# EAGLE design CBM_TAPE_PI (EAGLE 9.6.2)
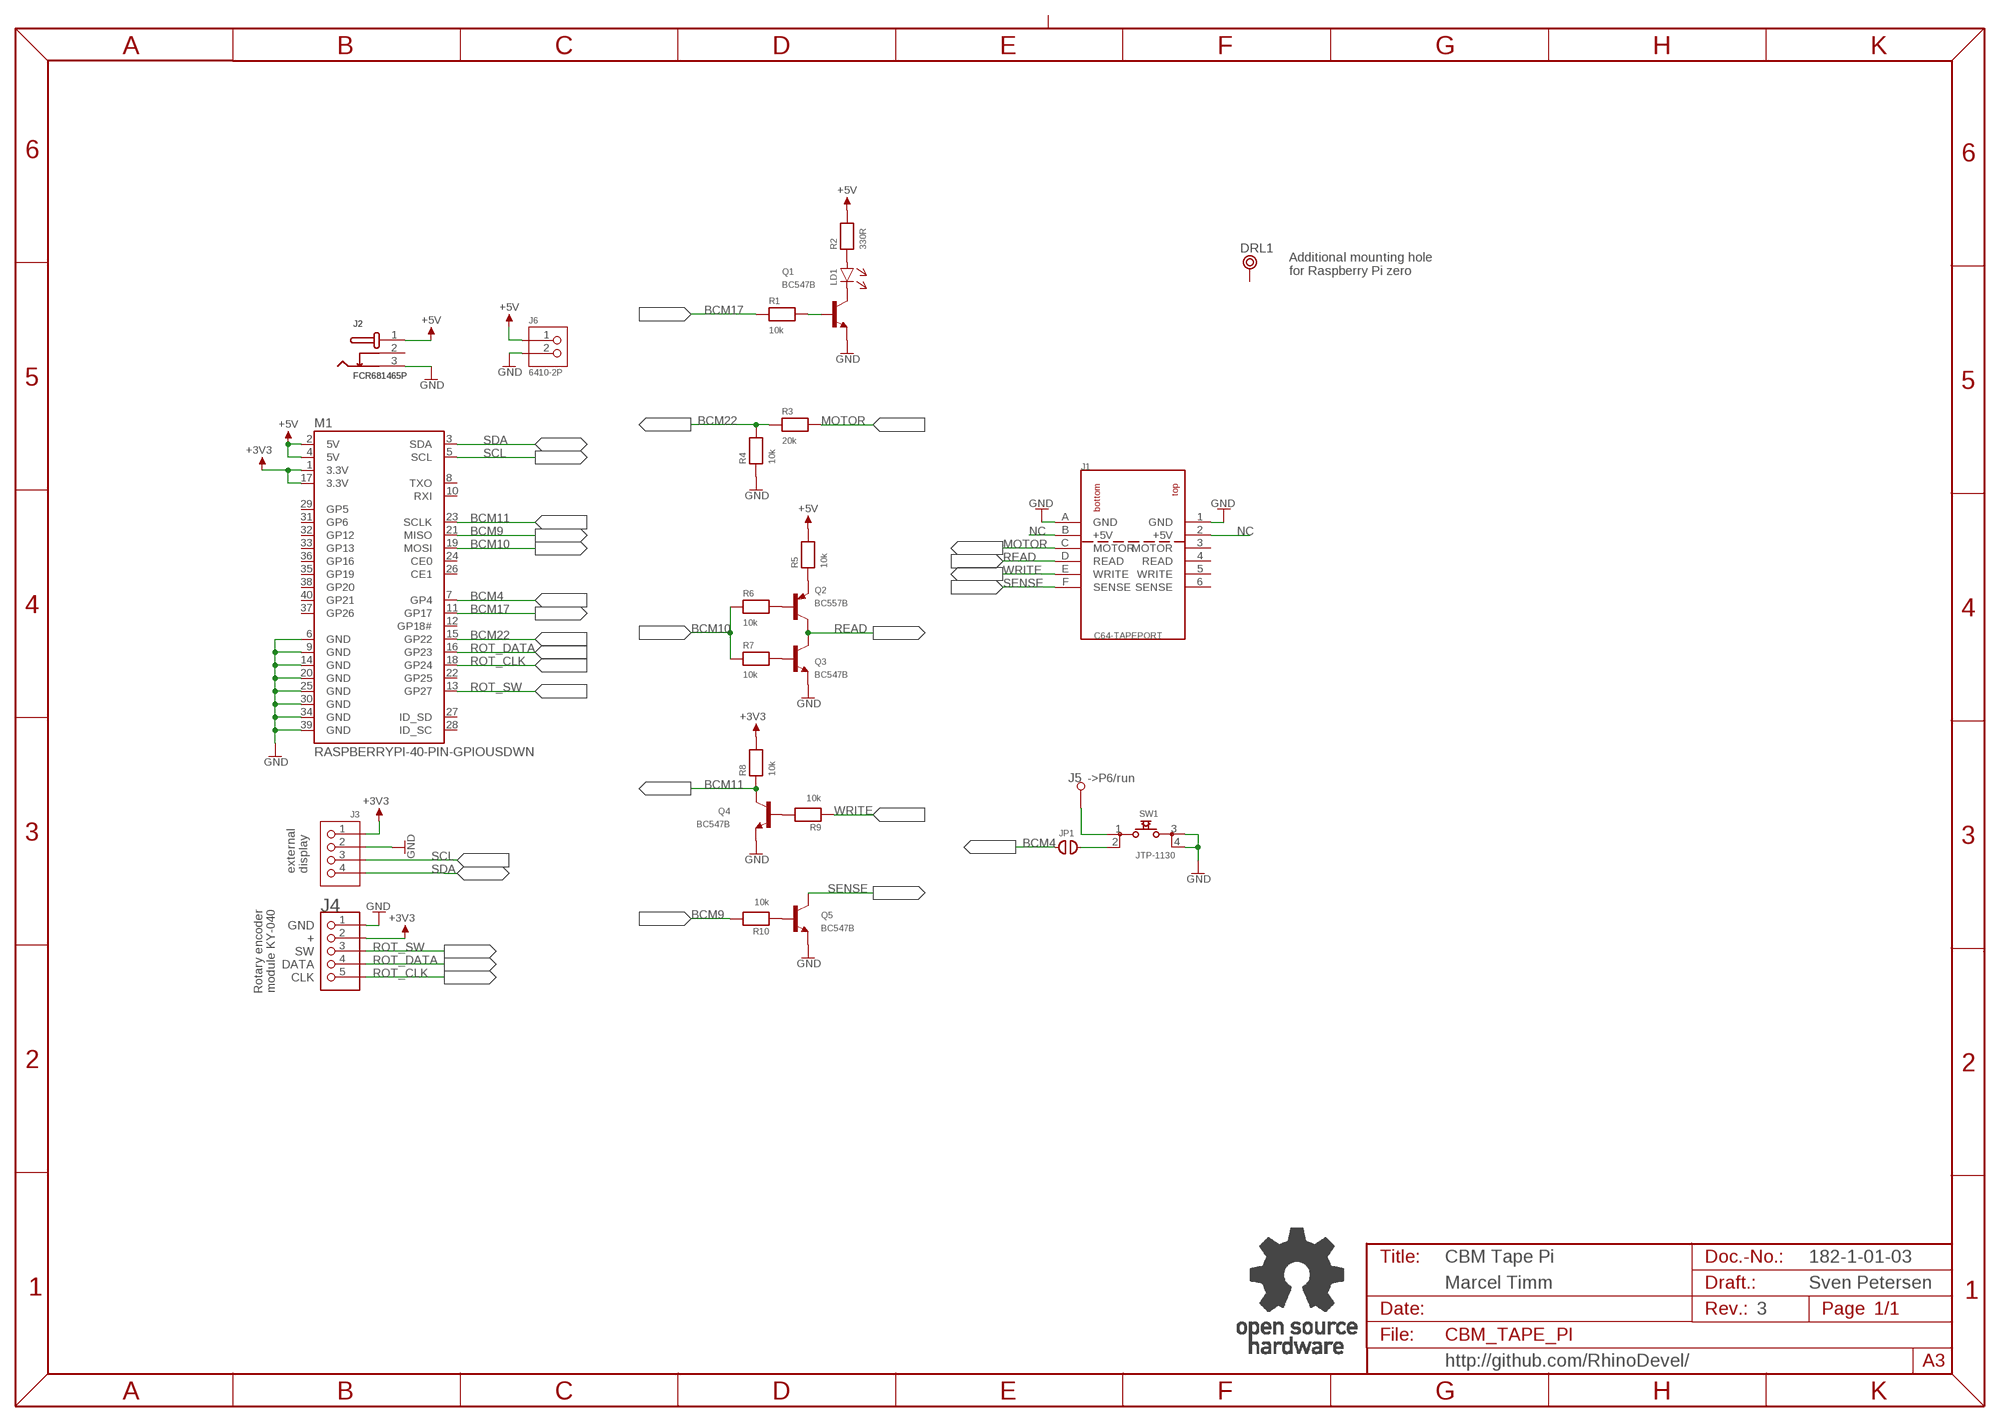
[diagram p0: schematic, sheet 1]

## Parts
DRL1  RPI_MNT  [RASPI_MNT]
J1  C64-TAPEPORT  [TAPEPORT]
J2  FCR681465P  [FCR681465P]
J3  6410-4P  [6410-4P]
J4  6410-5P  [6410-5P]
J5  L1,2_R  [1,2MM_R]
J6  6410-2P  [6410-2P]
JP1  OPEN  [CP_OP]
LD1  3MM  [3MM]
M1  RASPBERRYPI-40-PIN-GPIOUSDWN  [PI_HAT_40P_UPSIDEDOWN]
Q1  BC547B  [TO92]
Q2  BC557B  [TO92-EBC]
Q3  BC547B  [TO92]
Q4  BC547B  [TO92]
Q5  BC547B  [TO92]
R1  10k  RES04  [R-10]
R2  330R  RES04  [R-10]
R3  20k  RES04  [R-10]
R4  10k  RES04  [R-10]
R5  10k  RES04  [R-10]
R6  10k  RES04  [R-10]
R7  10k  RES04  [R-10]
R8  10k  RES04  [R-10]
R9  10k  RES04  [R-10]
R10  10k  RES04  [R-10]
SW1  JTP-1130  [JTP-1130]
U$2  OPEN_SOURCE_HW  [OPENHW]

## Nets
+3V3: J3.1 J4.2 M1.1(3.3V) M1.17(3.3V) R8.2
+5V: J2.1 J6.1 M1.2(5V) M1.4(5V) R2.2 R5.2
BCM4: JP1.1 M1.7(GP4)
BCM9: M1.21(MISO) R10.2
BCM10: M1.19(MOSI) R6.1 R7.1
BCM11: M1.23(SCLK) Q4.3(C) R8.1
BCM17: M1.11(GP17) R1.1
BCM22: M1.15(GP22) R3.1 R4.2
GND: J1.1(GND) J1.A(GND) J2.3 J3.2 J4.1 J6.2 M1.6(GND) M1.9(GND) M1.14(GND) M1.20(GND) M1.25(GND) M1.30(GND) M1.34(GND) M1.39(GND) Q1.1(E) Q3.1(E) Q4.1(E) Q5.1(E) R4.1 SW1.3 SW1.4
MOTOR: J1.C(MOTOR) R3.2
N$1: Q1.2(B) R1.2
N$2: LD1.C(K) Q1.3(C)
N$3: LD1.A R2.1
N$4: Q2.E R5.1
N$5: Q2.B R6.2
N$6: Q3.2(B) R7.2
N$7: Q4.2(B) R9.2
N$8: Q5.2(B) R10.1
N$9: J5.1 SW1.1
N$10: JP1.2 SW1.2
NC: J1.2(+5V) J1.B(+5V)
READ: J1.D(READ) Q2.C Q3.3(C)
ROT_CLK: J4.5 M1.18(GP24)
ROT_DATA: J4.4 M1.16(GP23)
ROT_SW: J4.3 M1.13(GP27)
SCL: J3.3 M1.5(SCL)
SDA: J3.4 M1.3(SDA)
SENSE: J1.F(SENSE) Q5.3(C)
WRITE: J1.E(WRITE) R9.1
Unconnected: DRL1.MH J1.3(MOTOR) J1.4(READ) J1.5(WRITE) J1.6(SENSE) J2.2 M1.8(TXO) M1.10(RXI) M1.12(GP18#) M1.22(GP25) M1.24(CE0) M1.26(CE1) M1.27(ID_SD) M1.28(ID_SC) M1.29(GP5) M1.31(GP6) M1.32(GP12) M1.33(GP13) M1.35(GP19) M1.36(GP16) M1.37(GP26) M1.38(GP20) M1.40(GP21)

## Notes on the sheet
- Additional mounting hole
  for Raspberry Pi zero
- ->P6/run
- external
  display
- GND
- +
- Rotary encoder
  module KY-040
- SW
- DATA
- CLK
- CBM Tape Pi | 182-1-01-03
- Marcel Timm | Sven Petersen
- 3
- http://github.com/RhinoDevel/

## Library data of the parts
DRL1 = Mech_Bohr:RPI_MNT
J1 = Commodore:C64-TAPEPORT
J2 = Cliff:FCR681465P
J3 = MOLEX:6410-4P: 6410/22-27-2041
J4 = MOLEX:6410-5P: 6410/22-27-2051
J5 = Pads:L1,2_R
J6 = MOLEX:6410-2P: 6410/22-27-2021
JP1 = Cutpad:OPEN: open Cutpad
LD1 = LED:3MM
M1 = Raspberry_Pi:RASPBERRYPI-40-PIN-GPIO: 40 pin GPIO header with the footprint of a HAT
Q1 Q3-Q5 = Transistoren:BC547*: NPN Transistor
Q2 = Transistoren:BC557*: PNP Transistror
R1-R10 = DISCRETE:RES04
SW1 = Namae_Electronics:JTP-1130
U$2 = Logo:OPEN_SOURCE_HW

## Board
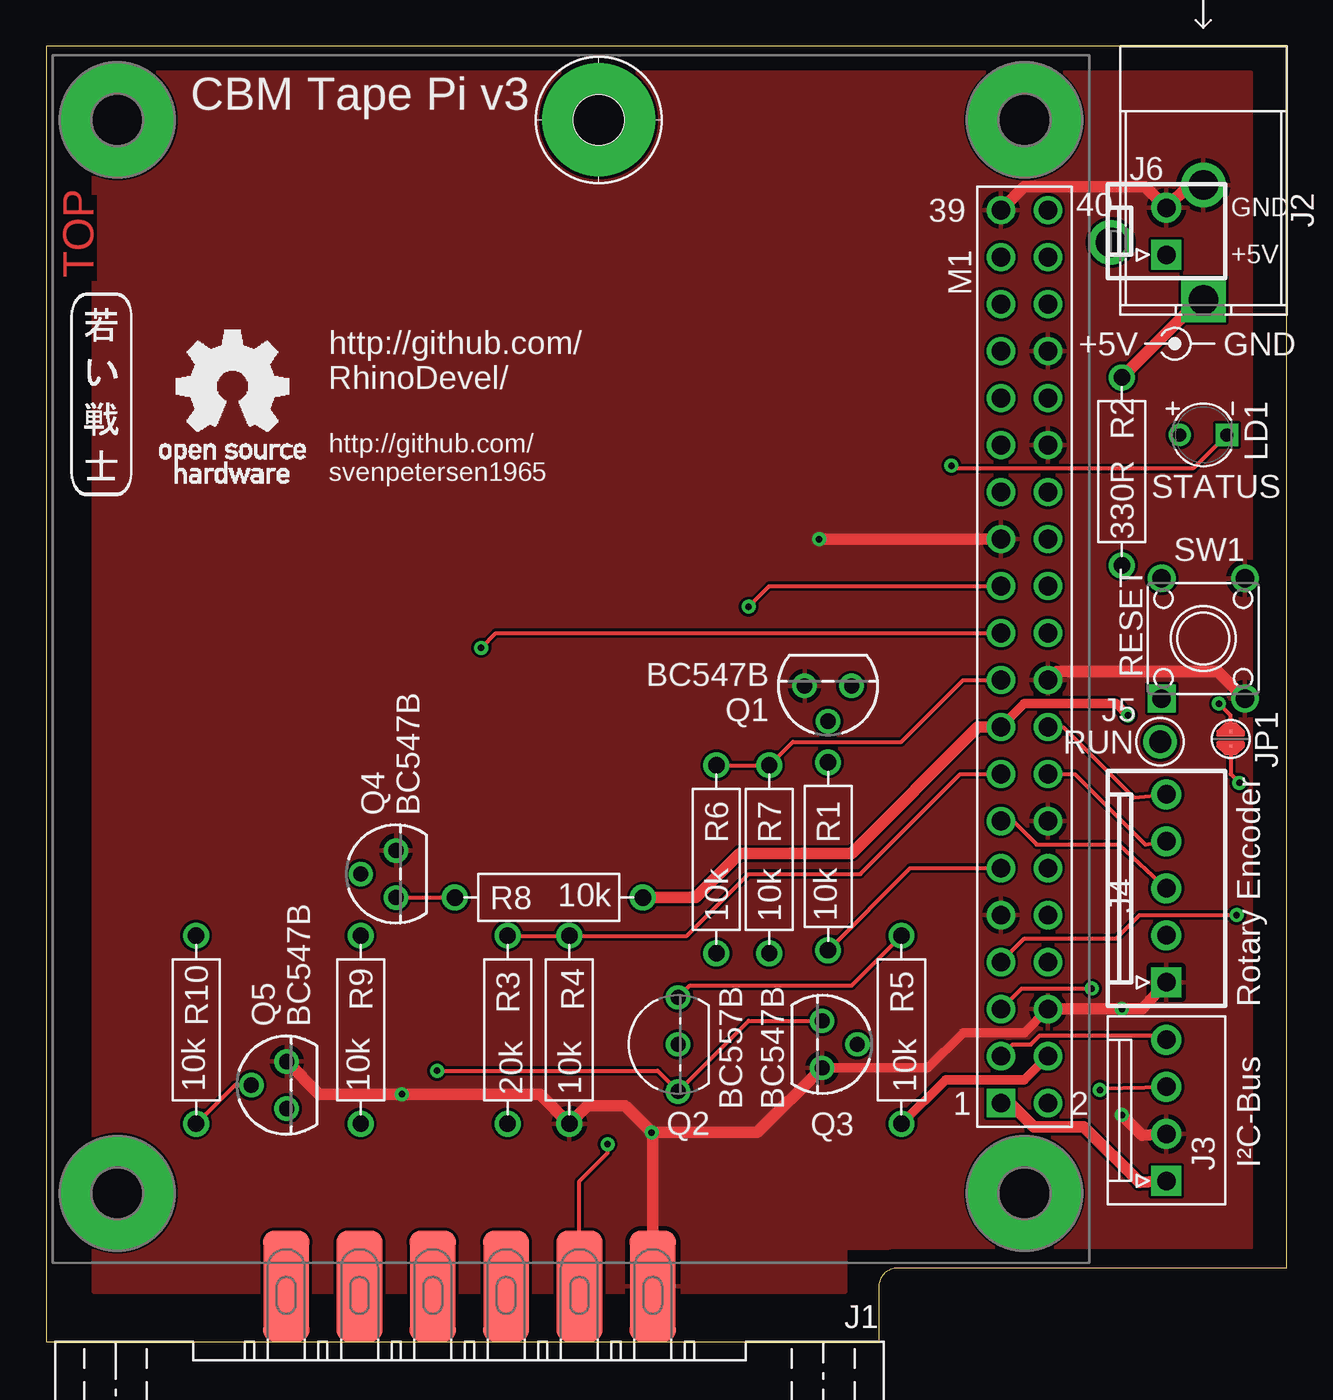
[diagram p1: board, top side]
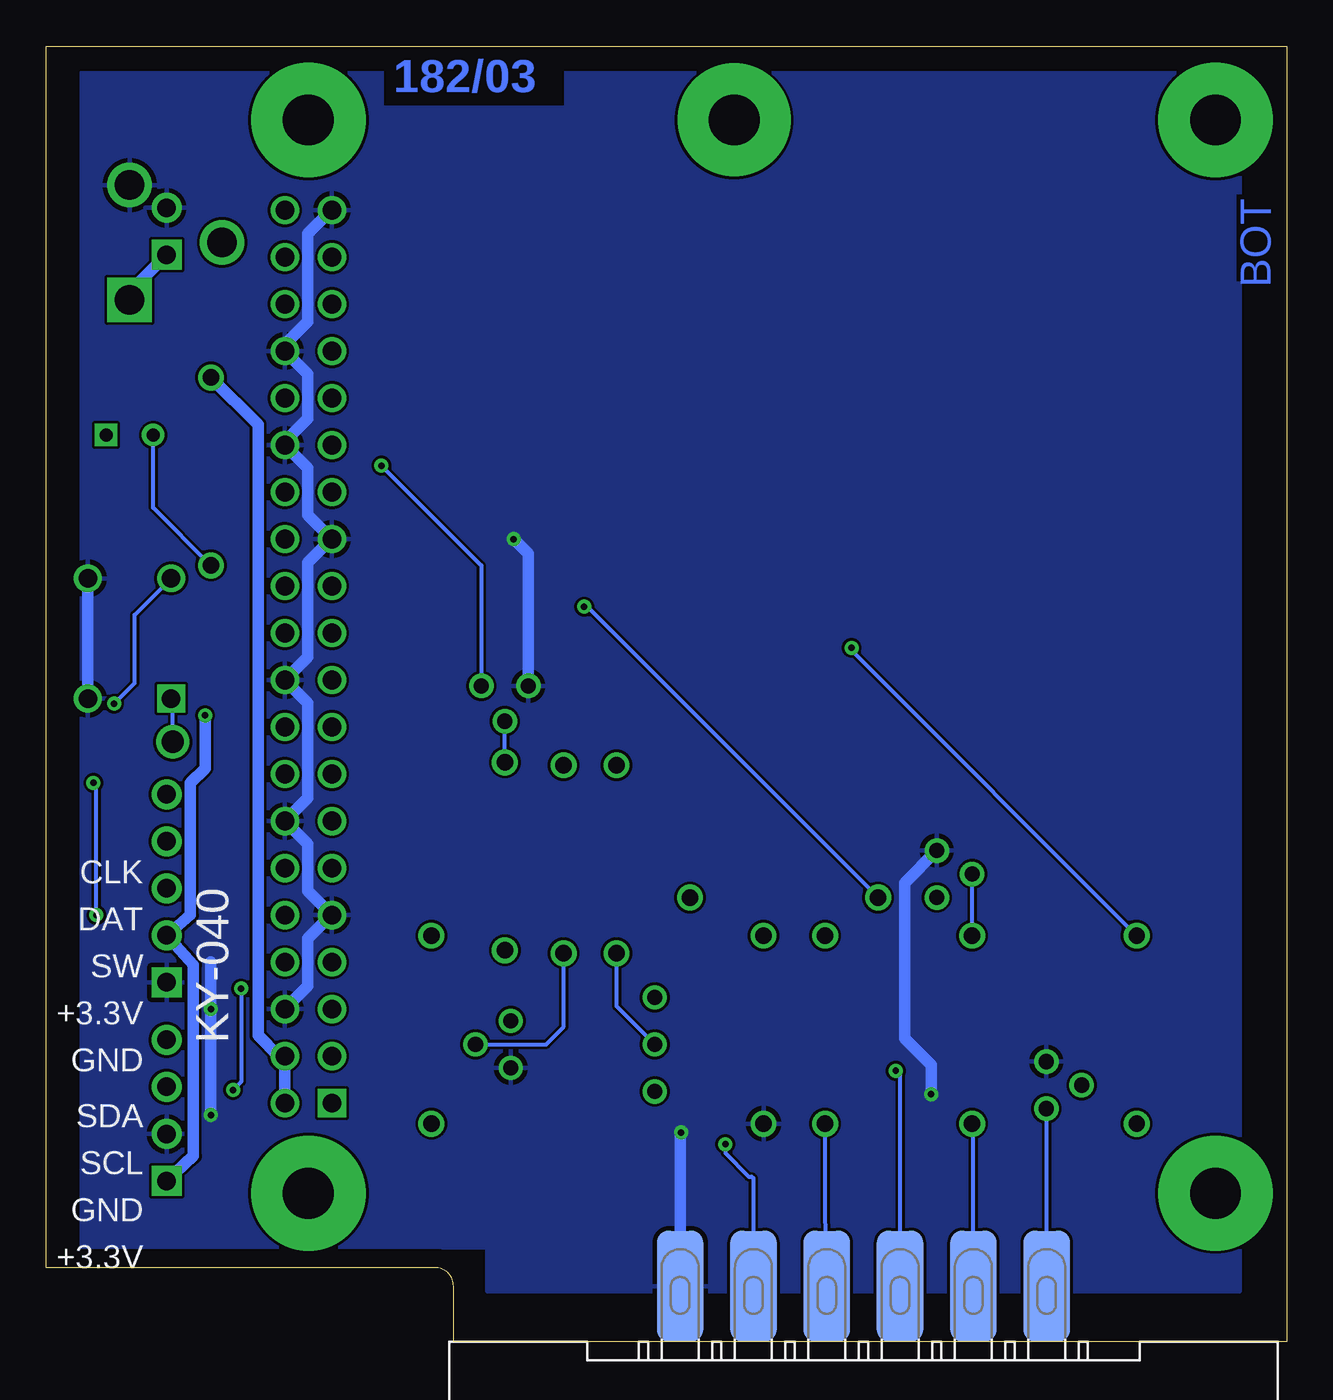
[diagram p2: board, bottom side, seen from below]

Size 67 x 70 mm. Coordinates in mm from the lower left corner, seen from the top.
Outline: 0,0 45,0 45,3 arc-90 46,4 67,4 67,70 0,70 0,0
Copper layers (1*16): Top 0.035mm / dielectric 1.5mm / Bottom 0.035mm
Design rules "default *": minimum track width 6mil, minimum drill 0.35mm, track to track 6mil, track to pad 6mil, pad to pad 6mil, via to via 6mil, smd to smd 6mil, copper to edge 40mil, drill to drill 6mil, minimum pad ring 10mil, minimum via ring 8mil, stop-mask expansion 4mil, vias tented up to drill 25mil, thermal gap 10mil
bRestrict: 3 lines

### Footprints (pad centres in the part's own frame; a part is rotated, then mirrored left to right if it is on the bottom)
RASPI_MNT = drill 2.75 pad 6.1: MH 0,0
TAPEPORT = smd 2.5 x 6: 1 -9.9,-3; 2 -5.94,-3; 3 -1.98,-3; 4 1.98,-3; 5 5.94,-3; 6 9.9,-3 | smd 2.5 x 6 bottom: A -9.9,-3; B -5.94,-3; C -1.98,-3; D 1.98,-3; E 5.94,-3; F 9.9,-3
FCR681465P = drill 1.6 square: 1 0,13.7 | drill 1.6: 2 5,10.6; 3 0,7.5
6410-4P = drill 1 pad 1.626 square: 1 -3.81,0 | drill 1 pad 1.626: 2 -1.27,0; 3 1.27,0; 4 3.81,0
6410-5P = drill 1 pad 1.626 square: 1 -5.08,0 | drill 1 pad 1.626: 2 -2.54,0; 3 0,0; 4 2.54,0; 5 5.08,0
1,2MM_R = drill 1.2: 1 0,0
6410-2P = drill 1 pad 1.626 square: 1 -1.27,0 | drill 1 pad 1.626: 2 1.27,0
CP_OP = smd 0.152 x 0.152: 1 -0.4,0; 2 0.4,0
3MM = drill 0.7: A -1.27,0 | drill 0.7 square: C 1.27,0
PI_HAT_40P_UPSIDEDOWN = drill 1.016 square: 1 1.27,24.13 | drill 1.016: 2 -1.27,24.13; 3 1.27,21.59; 4 -1.27,21.59; 5 1.27,19.05; 6 -1.27,19.05; 7 1.27,16.51; 8 -1.27,16.51; 9 1.27,13.97; 10 -1.27,13.97; 11 1.27,11.43; 12 -1.27,11.43; 13 1.27,8.89; 14 -1.27,8.89; 15 1.27,6.35; 16 -1.27,6.35; 17 1.27,3.81; 18 -1.27,3.81; 19 1.27,1.27; 20 -1.27,1.27; 21 1.27,-1.27; 22 -1.27,-1.27; 23 1.27,-3.81; 24 -1.27,-3.81; 25 1.27,-6.35; 26 -1.27,-6.35; 27 1.27,-8.89; 28 -1.27,-8.89; 29 1.27,-11.43; 30 -1.27,-11.43; 31 1.27,-13.97; 32 -1.27,-13.97; 33 1.27,-16.51; 34 -1.27,-16.51; 35 1.27,-19.05; 36 -1.27,-19.05; 37 1.27,-21.59; 38 -1.27,-21.59; 39 1.27,-24.13; 40 -1.27,-24.13 | drill 2.75 pad 6.2: BHR1 0,-29; BHR2 0,29; BHR3 49,29; BHR4 49,-29
TO92 = drill 0.813: 1 1.27,0; 2 0,1.905; 3 -1.27,0
TO92-EBC = drill 0.813: B 0,-1.27; C -2.54,-1.27; E 2.54,-1.27
R-10 = drill 0.889 pad 1.397: 1 -5.08,0; 2 5.08,0
JTP-1130 = drill 1 square: 1 3.25,-2.25 | drill 1: 2 -3.25,-2.25; 3 3.25,2.25; 4 -3.25,2.25

### Placement (x,y rotation side)
DRL1  29.84,66.02 0 top
J1  22.86,0 180 top
J2  62.5,70 180 top
J3  60.5,12.5 90 top
J4  60.5,24.5 90 top
J5  60.17,32.42 0 top
J6  60.5,60 90 top
JP1  63.98,32.58 90 top
LD1  62.5,49 0 top
M1  52.84,37.02 180 top
Q1  42.23,35.43 180 top
Q2  32.86,16.07 90 top
Q3  41.91,16.07 270 top
Q4  18.89,25.27 90 top
Q5  12.98,13.86 90 top
R1  42.23,26.23 90 top
R2  58.1,47.02 90 top
R3  24.92,16.86 270 top
R4  28.26,16.86 90 top
R5  46.2,16.86 270 top
R6  36.2,26.07 270 top
R7  39.05,26.07 270 top
R8  27.15,24 0 top
R9  16.99,16.86 90 top
R10  8.1,16.86 90 top
SW1  62.5,38 270 top
U$2  6.12,46.4 0 top
U$53  [2LAYER]  2.54,57.5 90 top
U$54  [SVEN_TAG]  3.02,51.31 0 top
U$55  [PCB-TITLE/]  0,80.2 0 top  (outside the outline)

### Tracks (layer width: path | path; a pad name or v marks a point on that pad's centre or on a via)
+3V3  (via drill 0.35)
  Top 0.508: v58.42,33.84 57.78,34.48 52.84,34.48 M1.17
  Top 0.61: R8.2 35.08,24 37.47,26.38 43.5,26.38 50.32,33.21 M1.17 | M1.1 52.07,12.89 53.34,11.62 56.04,11.62 59.05,8.6 J3.1
  Bottom 0.61: J3.1 59.05,10.03 59.05,20.35 J4.2 59.21,23.05 59.21,30.19 58.42,30.99 v58.42,33.84
+5V
  Top 0.508: R5.2 48.58,14.16 52.84,14.16 M1.4
  Top 0.61: R2.2 62.3,56.3 J2.1
  Bottom 0.61: M1.2 M1.4 54.45,15.43 55.56,16.54 55.56,49.56 R2.2 | J2.1 62.5,56.73 J6.1
BCM4  (via drill 0.35)
  Top 0.203: M1.7 52.84,21.78 57.78,21.78 59.05,23.05 v64.29,23.05 | JP1.1 63.98,30.67 v64.45,30.19
  Bottom 0.203: v64.29,23.05 64.29,30.04 v64.45,30.19
BCM9  (via drill 0.35)
  Top 0.203: v23.5,37.5 24.29,38.29 M1.21
  Bottom 0.203: R10.2 23.5,37.34 v23.5,37.5
BCM10
  Top 0.203: R6.1 R7.1 40.32,32.42 46.2,32.42 49.53,35.75 M1.19
BCM11  (via drill 0.35)
  Top 0.203: Q4.3 R8.1 | v37.94,39.72 39.05,40.83 M1.23
  Bottom 0.203: R8.1 37.78,39.72 v37.94,39.72
BCM17
  Top 0.203: R1.1 46.67,25.59 M1.11
BCM22
  Top 0.203: R3.1 R4.2 34.61,21.94 37.94,25.27 43.97,25.27 49.37,30.67 M1.15
GND  (via drill 0.35)
  Top 0.508: Q3.1 47.62,14.79 49.53,16.7 52.84,16.7 M1.6
  Top 0.61: J1.1 32.76,11.24 v32.7,11.3 | v32.7,11.3 38.42,11.3 Q3.1 | v32.7,11.3 31.27,12.73 29.21,12.73 R4.1 26.67,13.37 v19.21,13.37 14.75,13.37 Q5.1 | M1.6 v58.1,17.97 59.21,17.97 J4.1 | M1.20 54.59,36.23 63.27,36.23 SW1.3 | M1.39 52.84,62.42 59.35,62.42 J6.2 61.73,62.5 J2.3 | v58.1,12.26 59.21,11.14 J3.2 | v41.75,43.37 M1.25
  Bottom 0.61: J1.1 32.76,11.24 v32.7,11.3 | Q4.1 20.64,24.8 20.64,16.38 19.21,14.95 v19.21,13.37 | v58.1,12.26 v58.1,17.97 58.1,20.51 | M1.6 52.86,19.22 52.86,21.78 51.59,23.05 M1.9 52.86,24.34 52.86,26.88 M1.14 52.86,29.38 52.86,34.5 M1.20 52.86,37 52.86,42.1 51.59,43.37 M1.25 52.86,44.66 52.86,47.2 M1.30 54.11,48.63 52.86,49.88 52.86,52.28 M1.34 54.11,53.87 52.86,55.12 52.86,59.88 51.59,61.15 M1.39 | Q1.1 40.96,42.58 v41.75,43.37 | SW1.3 SW1.4
  pour Top: 2.54,2.7 43.18,2.7 43.18,5.08 65.09,5.08 65.09,68.58 2.54,68.58
  pour Bottom: 2.54,2.7 43.18,2.7 43.18,5.08 65.09,5.08 65.09,68.58 2.54,68.58
MOTOR
  Bottom 0.203: J1.C 24.92,7.08 R3.2
N$1
  Bottom 0.203: R1.2 Q1.2
N$2  (via drill 0.35)
  Top 0.203: LD1.C 61.95,47.18 49.05,47.18 v48.9,47.34
  Bottom 0.203: v48.9,47.34 43.5,41.94 Q1.3
N$3
  Bottom 0.203: R2.1 61.23,45.07 LD1.A
N$4
  Top 0.203: Q2.E 34.77,19.24 43.5,19.24 R5.1
N$5
  Bottom 0.203: Q2.B 36.2,18.13 R6.2
N$6
  Bottom 0.203: Q3.2 40.01,16.07 39.05,17.02 R7.2
N$7
  Bottom 0.203: R9.2 Q4.2
N$8
  Top 0.203: R10.1 10.18,13.86 Q5.2
N$9
  Bottom 0.203: J5.1 60.17,34.67 SW1.1
N$10  (via drill 0.35)
  Top 0.203: JP1.2 63.98,33.84 v63.34,34.48
  Bottom 0.203: v63.34,34.48 62.23,35.59 62.23,39.27 SW1.2
NC  (via drill 0.35)
  Top 0.203: J1.2 28.8,8.67 30.32,10.19 v30.32,10.67
  Bottom 0.203: v30.32,10.67 30.32,10.19 29.05,8.92 28.89,8.92 28.8,8.83 J1.2
READ  (via drill 0.35)
  Top 0.203: v21.11,14.64 33.02,14.64 Q2.C 37.94,17.34 Q3.3
  Bottom 0.203: J1.D 20.88,14.4 v21.11,14.64
ROT_CLK
  Top 0.203: M1.18 54.93,33.21 58.74,29.4 J4.5
ROT_DATA
  Top 0.203: M1.16 55.56,30.67 59.37,26.86 J4.4
ROT_SW
  Top 0.203: M1.13 52.23,28.13 53.5,26.86 57.94,26.86 J4.3
SCL  (via drill 0.35)
  Top 0.203: M1.5 52.68,19.08 v56.47,19.08 | v56.47,19.08 56.52,19.08 v56.47,19.08 | v56.91,13.6 56.99,13.68 J3.3
  Bottom 0.203: v56.47,19.08 56.47,14.04 v56.91,13.6
SDA
  Top 0.203: M1.3 52.2,16.07 53.18,16.07 53.66,16.54 60.17,16.54 J3.4
SENSE
  Bottom 0.203: J1.F 12.96,12.57 Q5.3
WRITE
  Bottom 0.203: J1.E 16.92,11.71 R9.1

### Text on the board
Bottom: 182/03
tPlace: CBM Tape Pi v3 | +5V | GND | http://github.com/ / RhinoDevel/ | STATUS | RESET
bPlace: CLK | DAT | KY-040 | SW | +3.3V | GND | SDA | SCL | GND | +3.3V
tNames: GND | +5V | http://github.com/ / svenpetersen1965 | RUN | Rotary Encoder | I²C-Bus
Document: Marcel Timm | 182-2-01-03 | 2021 | 35µm | 3